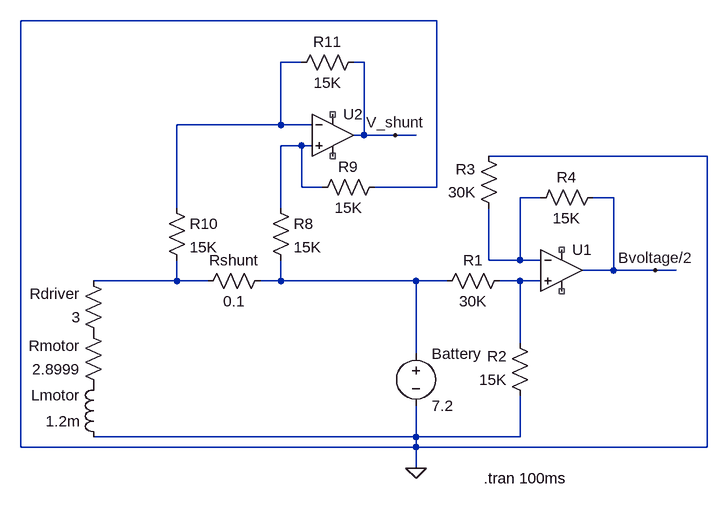
[diagram p0: schematic Test_Circuit.asc]
Test_Circuit.asc, the LTspice schematic file:
Version 4
SHEET 1 880 680
WIRE 128 -400 -512 -400
WIRE -80 -336 -112 -336
WIRE 16 -336 0 -336
WIRE -112 -240 -112 -336
WIRE -112 -240 -272 -240
WIRE -64 -240 -112 -240
WIRE 16 -224 16 -336
WIRE 16 -224 0 -224
WIRE 64 -224 16 -224
WIRE 96 -224 64 -224
WIRE -80 -208 -112 -208
WIRE -64 -208 -80 -208
WIRE 544 -192 208 -192
WIRE -80 -144 -80 -208
WIRE -48 -144 -80 -144
WIRE 128 -144 128 -400
WIRE 128 -144 32 -144
WIRE 288 -128 256 -128
WIRE 400 -128 368 -128
WIRE -272 -112 -272 -240
WIRE -112 -112 -112 -208
WIRE 208 -32 208 -112
WIRE 256 -32 256 -128
WIRE 256 -32 208 -32
WIRE 288 -32 256 -32
WIRE 400 -16 400 -128
WIRE 400 -16 352 -16
WIRE 464 -16 400 -16
WIRE 496 -16 464 -16
WIRE -272 0 -272 -32
WIRE -272 0 -400 0
WIRE -224 0 -272 0
WIRE -112 0 -112 -32
WIRE -112 0 -144 0
WIRE 96 0 -112 0
WIRE 144 0 96 0
WIRE 256 0 224 0
WIRE 288 0 256 0
WIRE 256 96 256 0
WIRE 96 112 96 0
WIRE 96 240 96 192
WIRE 96 240 -400 240
WIRE 256 240 256 176
WIRE 256 240 96 240
WIRE -512 256 -512 -400
WIRE 96 256 96 240
WIRE 96 256 -512 256
WIRE 544 256 544 -192
WIRE 544 256 96 256
WIRE 96 288 96 256
FLAG 96 288 0
FLAG 464 -16 Bvoltage/2
FLAG 64 -224 V_shunt
SYMBOL voltage 96 96 R0
WINDOW 123 0 0 Left 0
WINDOW 39 0 0 Left 0
SYMATTR InstName Battery
SYMATTR Value 7.2
SYMBOL OpAmps\\UniversalOpAmp 320 -16 R0
SYMATTR InstName U1
SYMBOL res 240 -16 R90
WINDOW 0 0 56 VBottom 2
WINDOW 3 32 56 VTop 2
SYMATTR InstName R1
SYMATTR Value 30K
SYMBOL res 272 192 R180
WINDOW 0 36 76 Left 2
WINDOW 3 36 40 Left 2
SYMATTR InstName R2
SYMATTR Value 15K
SYMBOL res 224 -96 R180
WINDOW 0 36 76 Left 2
WINDOW 3 36 40 Left 2
SYMATTR InstName R3
SYMATTR Value 30K
SYMBOL res 384 -144 R90
WINDOW 0 0 56 VBottom 2
WINDOW 3 32 56 VTop 2
SYMATTR InstName R4
SYMATTR Value 15K
SYMBOL res -128 -16 R90
WINDOW 0 0 56 VBottom 2
WINDOW 3 32 56 VTop 2
SYMATTR InstName Rshunt
SYMATTR Value 0.1
SYMBOL res -384 96 R180
WINDOW 0 36 76 Left 2
WINDOW 3 36 40 Left 2
SYMATTR InstName Rdriver
SYMATTR Value 3
SYMBOL res -384 176 R180
WINDOW 0 36 76 Left 2
WINDOW 3 36 40 Left 2
SYMATTR InstName Rmotor
SYMATTR Value 2.8999
SYMBOL ind -384 256 R180
WINDOW 0 36 80 Left 2
WINDOW 3 36 40 Left 2
SYMATTR InstName Lmotor
SYMATTR Value 1.2m
SYMBOL OpAmps\\UniversalOpAmp -32 -224 R0
SYMATTR InstName U2
SYMBOL res -128 -128 R0
SYMATTR InstName R8
SYMATTR Value 15K
SYMBOL res 48 -160 R90
WINDOW 0 0 56 VBottom 2
WINDOW 3 32 56 VTop 2
SYMATTR InstName R9
SYMATTR Value 15K
SYMBOL res -288 -128 R0
SYMATTR InstName R10
SYMATTR Value 15K
SYMBOL res 16 -352 R90
WINDOW 0 0 56 VBottom 2
WINDOW 3 32 56 VTop 2
SYMATTR InstName R11
SYMATTR Value 15K
TEXT 200 304 Left 2 !.tran 100ms

The netlist it stands for:
* Test_Circuit.asc
V§Battery N005 0 7.2
XU1 N006 N003 NC_01 NC_02 Bvoltage/2 level1 Avol=1Meg GBW=10Meg Vos=0 En=0 Enk=0 In=0 Ink=0 Rin=500Meg  ; pins In+ In- V+ V- OUT
R1 N006 N005 30K
R2 0 N006 15K
R3 N003 0 30K
R4 Bvoltage/2 N003 15K
Rshunt N005 N004 0.1
Rdriver P001 N004 3
Rmotor P002 P001 2.8999
Lmotor 0 P002 1.2m
XU2 N002 N001 NC_03 NC_04 V_shunt level1 Avol=1Meg GBW=10Meg Vos=0 En=0 Enk=0 In=0 Ink=0 Rin=500Meg  ; pins In+ In- V+ V- OUT
R8 N002 N005 15K
R9 0 N002 15K
R10 N001 N004 15K
R11 V_shunt N001 15K
.tran 100ms
.lib UniversalOpAmp1.lib
.backanno
.end